# Altium schematic sheet Limit switches.SchDoc: Limit switches
size A4; DrawnBy: oaba200
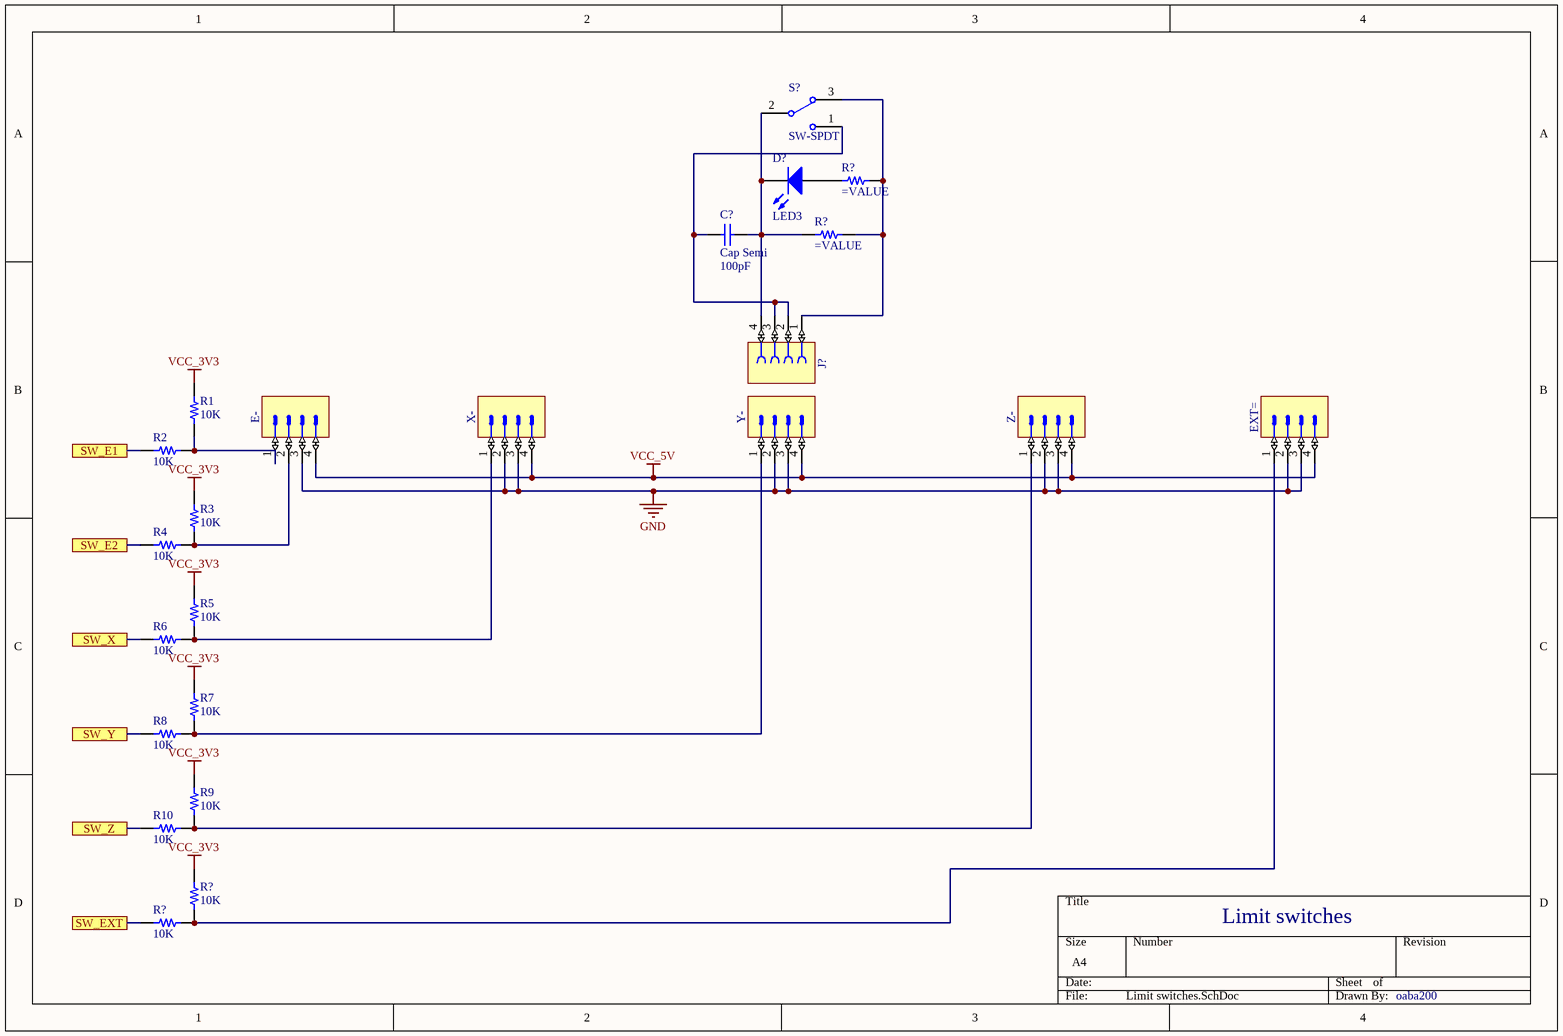
[diagram p0: Limit switches.SchDoc]

## Parts
(Parts that share a designator on the sheet are numbered #1, #2 ... from top to bottom, then left to right.)
C?  Cap Semi  value 100pF  [C1206]
D?  LED3  [3.5X2.8X1.9]
E-  (no value)
EXT=  (no value)
J?  (no value)
R1  10K  [RES 0805_2012]
R2  10K  [RES 0805_2012]
R3  10K  [RES 0805_2012]
R4  10K  [RES 0805_2012]
R5  10K  [RES 0805_2012]
R6  10K  [RES 0805_2012]
R7  10K  [RES 0805_2012]
R8  10K  [RES 0805_2012]
R9  10K  [RES 0805_2012]
R10  10K  [RES 0805_2012]
R?#1  (no value)  [RES 0805_2012]
R?#2  (no value)  [RES 0805_2012]
R?#3  10K  [RES 0805_2012]
R?#4  10K  [RES 0805_2012]
S?  SW-SPDT  [TL36WW15050]
X-  (no value)
Y-  (no value)
Z-  (no value)

## Ports
SW_E1, SW_E2, SW_EXT, SW_X, SW_Y, SW_Z

## Nets
GND: E-.3 EXT=.2 EXT=.3 X-.2 X-.3 Y-.2 Y-.3 Z-.2 Z-.3
VCC_3V3: R1.1 R3.2 R5.1 R7.2 R9.1 R?#3.1
VCC_5V: E-.4 EXT=.4 X-.4 Y-.4 Z-.4
SW_E1: R2.1 ; port SW_E1
SW_E2: R4.2 ; port SW_E2
SW_EXT: R?#4.1 ; port SW_EXT
SW_X: R6.1 ; port SW_X
SW_Y: R8.2 ; port SW_Y
SW_Z: R10.1 ; port SW_Z
NetC?_1: C?.1 J?.2 J?.3 S?.1
NetC?_2: C?.2 D?.2(K) J?.4 R?#2.1 S?.2
NetD?_1: D?.1(A) R?#1.1
NetE-_1: E-.1 R1.2 R2.2
NetE-_2: E-.2 R3.1 R4.1
NetEXT=_1: EXT=.1 R?#3.2 R?#4.2
NetJ?_1: J?.1 R?#1.2 R?#2.2 S?.3
NetR5_2: R5.2 R6.2 X-.1
NetR7_1: R7.1 R8.1 Y-.1
NetR9_2: R9.2 R10.2 Z-.1

## Library data of the parts
C? = Cap Semi: Capacitor (Semiconductor SIM Model); Published: 8-Jun-2000; LatestRevisionDate: 29-May-2009; LatestRevisionNote: IPC-7351 Footprint Added.; PackageReference: C1206; Publisher: Altium Limited; PackageDescription: Chip Capacitor
D? = LED3: Typical BLUE SiC LED; Published: 8-Jun-2000; LatestRevisionDate: 17-Dec-2003; LatestRevisionNote: PCB Footprint replaced.; DatasheetVersion: 16-Apr-2002; PackageVersion: 16-Apr-2002; PackageReference: 3.5X2.8X1.9; Publisher: Altium Limited; PackageDescription: SM LED; 2 C-Bend Leads; Body 3.5 x 2.8 x 1.9 mm, inc leads (LxWxH typ)
E- EXT= X- Y- Z- = Connector 4 Male
J? = Connector 4 Female
R1-R10 R?#1-R?#4 = Resistor: SMT Resistor
  R1-R10 R?#3 R?#4: VALUE: 10K
S? = SW-SPDT: SPDT Subminiature Toggle Switch, Right Angle Mounting, Vertical Actuation; Published: 24-Mar-1999; LatestRevisionDate: 17-Dec-2003; LatestRevisionNote: Schematic revised, PCB Footprint replaced.; DatasheetVersion: 05-Dec-2000; PackageReference: TL36WW15050; Publisher: Altium Limited; PackageDescription: Switch; 4 Leads; ComponentLink1Description: Manufacturer Link; ComponentLink1URL: http://www.apem.com